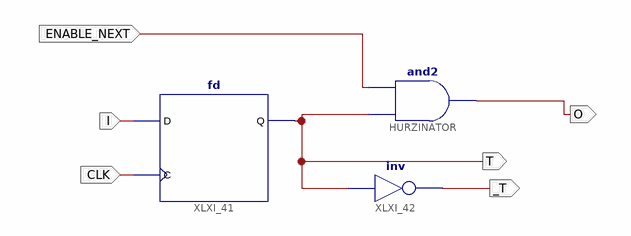
[diagram p0: schematic sheet 1]
// Xilinx ISE schematic delay.sch (spartan6) as structural Verilog: 3 symbols, 6 ports
module delay (
  input  I,
  input  CLK,
  input  ENABLE_NEXT,
  output O,
  output T,
  output _T
);

  fd XLXI_41 (.C(CLK), .D(I), .Q(T));
  not XLXI_42 (_T, T);
  and HURZINATOR (O, T, ENABLE_NEXT);
endmodule
